# EAGLE design Motor CC (EAGLE 6.4)
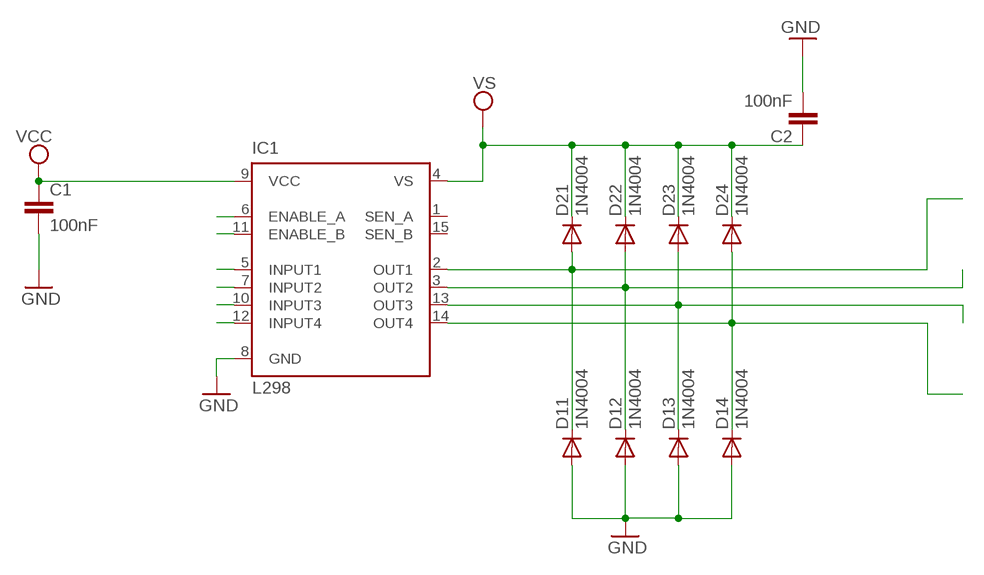
[diagram p0: schematic, sheet 1]

## Parts
C1  100nF  C-EU025-030X050  [C025-030X050]
C2  100nF  C-EU025-030X050  [C025-030X050]
D11  1N4004  [DO41-10]
D12  1N4004  [DO41-10]
D13  1N4004  [DO41-10]
D14  1N4004  [DO41-10]
D21  1N4004  [DO41-10]
D22  1N4004  [DO41-10]
D23  1N4004  [DO41-10]
D24  1N4004  [DO41-10]
IC1  L298  [MULTIWATT-15]

## Nets
GND: C1.2 C2.2 D11.A D12.A D13.A D14.A IC1.8(GND)
N$1: D14.C D24.A IC1.14(OUT4)
N$2: D11.C D21.A IC1.2(OUT1)
N$3: D12.C D22.A IC1.3(OUT2)
N$4: D13.C D23.A IC1.13(OUT3)
N$5: IC1.6(ENABLE_A)
N$6: IC1.11(ENABLE_B)
N$7: IC1.5(INPUT1)
N$8: IC1.7(INPUT2)
N$9: IC1.10(INPUT3)
N$10: IC1.12(INPUT4)
VSS: C1.1 C2.1 D21.C D22.C D23.C D24.C IC1.4(VS) IC1.9(VCC) ; supply symbol labelled VS, VCC
Unconnected: IC1.1(SEN_A) IC1.15(SEN_B)

## Library data of the parts
C1 C2 = resistor:C-EU: CAPACITOR, European symbol
D11-D14 D21-D24 = diode:1N4004: DIODE general purpose rectifier, 1 A
IC1 = st-microelectronics:L298: DUAL FULL-BRIDGE DRIVER; MPN: L298N; OC_FARNELL: 1589425; OC_NEWARK: 32M1527

## Board
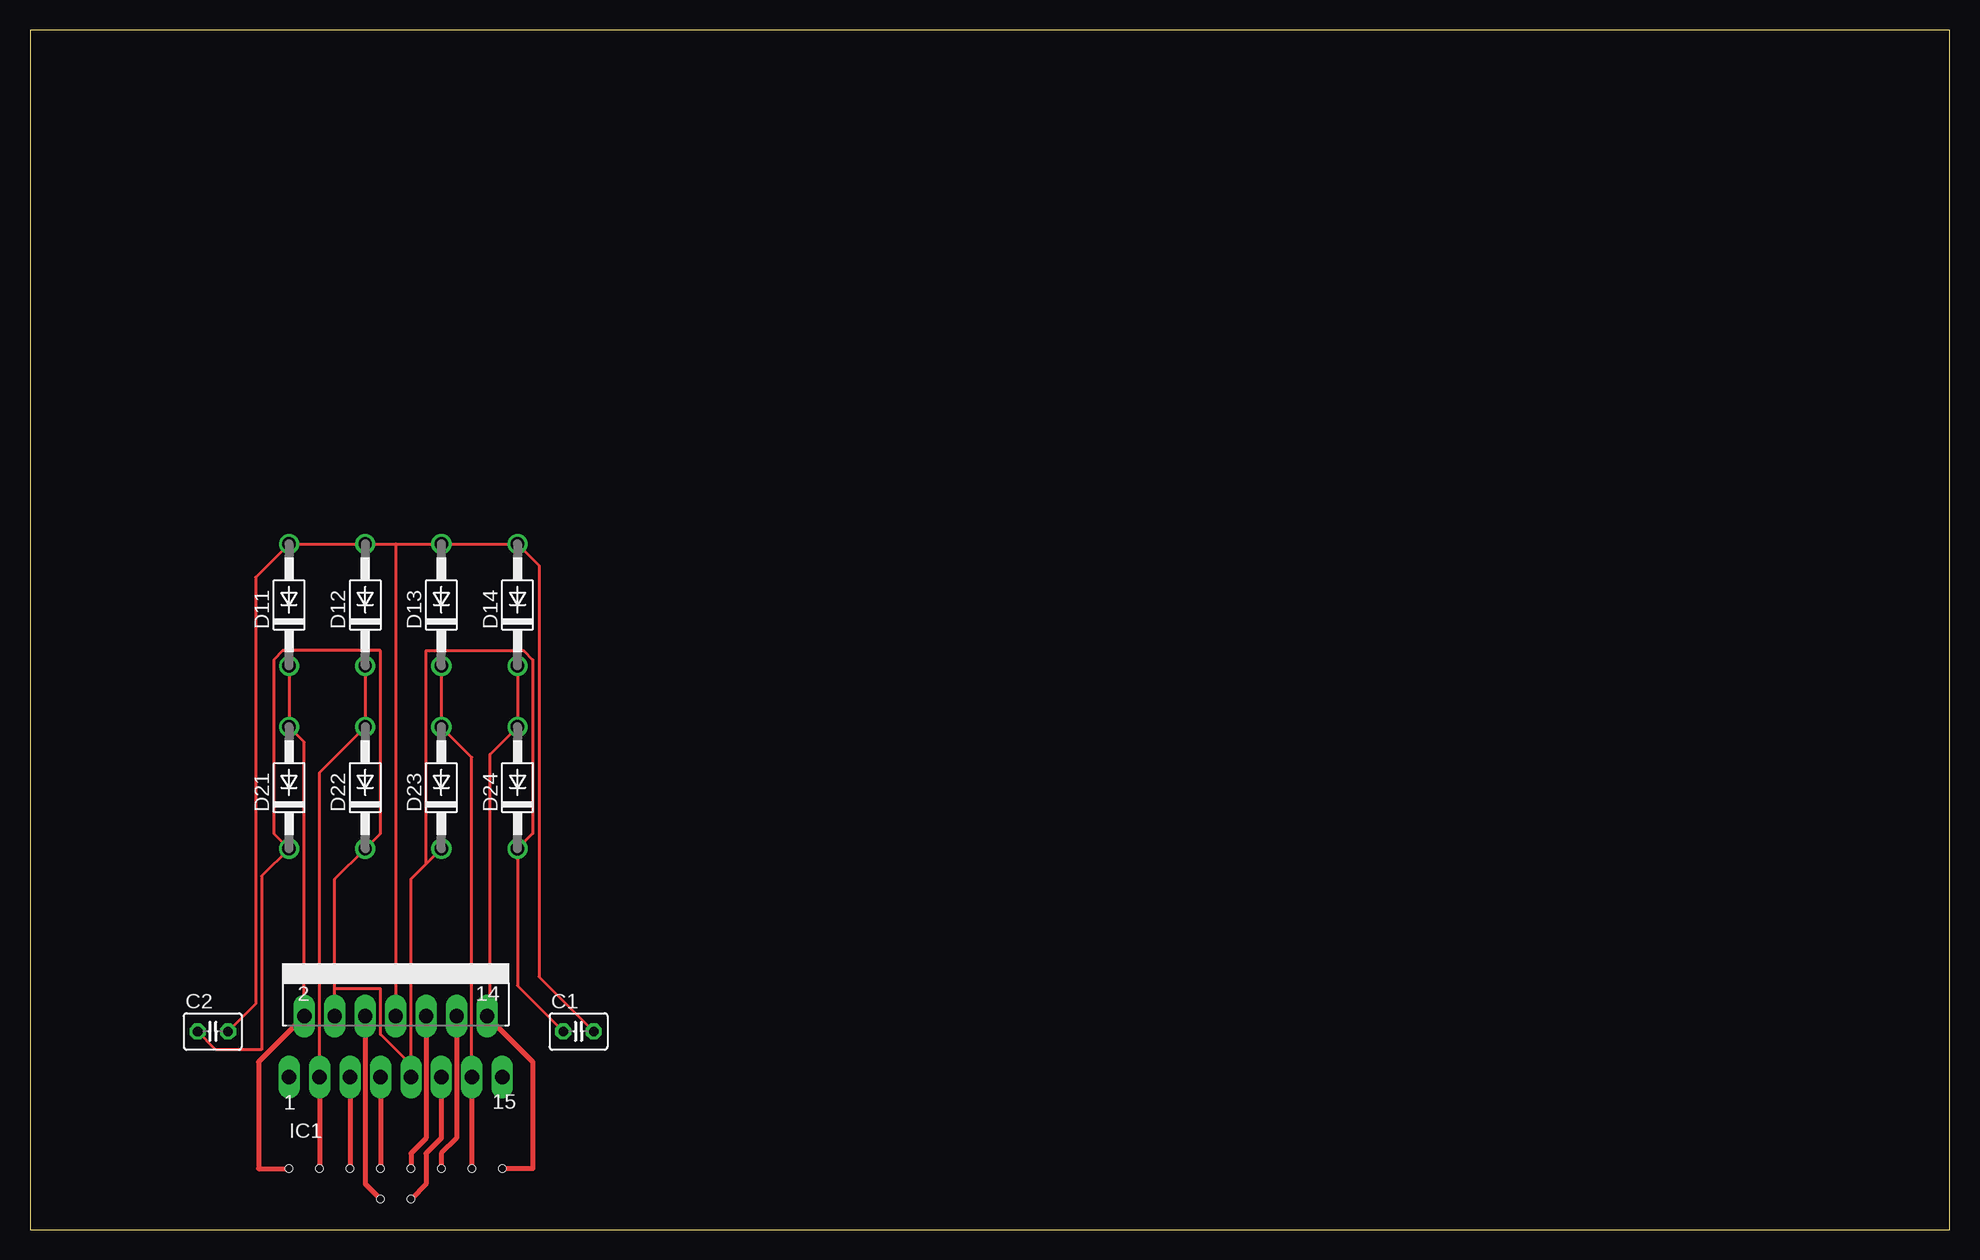
[diagram p1: board, top side]

Size 160 x 100 mm. Coordinates in mm from the lower left corner, seen from the top.
Outline: 0,0 160,0 160,100 0,100 0,0
Copper layers (1*16): Top 0.035mm / dielectric 1.5mm / Bottom 0.035mm
Design rules "default": minimum track width 10mil, minimum drill 24mil, track to track 8mil, track to pad 8mil, pad to pad 8mil, via to via 8mil, smd to smd 8mil, copper to edge 40mil, drill to drill 8mil, minimum pad ring 10mil, minimum via ring 8mil, stop-mask expansion 4mil, vias tented up to drill 0mil, thermal gap 10mil
Holes 0.6 mm at 21.59,5.08 24.13,5.08 26.67,5.08 29.21,2.54 29.21,5.08 31.75,5.08 31.75,2.54 34.29,5.08 36.83,5.08 39.37,5.08

### Footprints (pad centres in the part's own frame; a part is rotated, then mirrored left to right if it is on the bottom)
C025-030X050 = drill 0.813 octagon: 1 -1.27,0; 2 1.27,0
DO41-10 = drill 1.118: A 5.08,0; C -5.08,0
MULTIWATT-15 = drill 1.2 long: 1 -8.89,-7.62; 2 -7.62,-2.54; 3 -6.35,-7.62; 4 -5.08,-2.54; 5 -3.81,-7.62; 6 -2.54,-2.54; 7 -1.27,-7.62; 8 0,-2.54; 9 1.27,-7.62; 10 2.54,-2.54; 11 3.81,-7.62; 12 5.08,-2.54; 13 6.35,-7.62; 14 7.62,-2.54; 15 8.89,-7.62

### Placement (x,y rotation side)
C1  45.72,16.51 0 top
C2  15.24,16.51 0 top
D11  21.59,52.07 90 top
D12  27.94,52.07 90 top
D13  34.29,52.07 90 top
D14  40.64,52.07 90 top
D21  21.59,36.83 90 top
D22  27.94,36.83 90 top
D23  34.29,36.83 90 top
D24  40.64,36.83 90 top
IC1  30.48,20.32 0 top

### Tracks (layer width: path | path; a pad name or v marks a point on that pad's centre or on a via)
GND
  Top 0.254: C1.2 42.42,21.08 42.42,55.37 D14.A D13.A 30.48,57.15 | C2.2 18.8,18.8 18.8,54.36 D11.A D12.A 30.48,57.15 | 30.48,57.15 IC1.8
N$1
  Top 0.254: D14.C D24.A 38.35,39.62 38.35,17.78 IC1.14
  Top 0.406: IC1.14 41.91,13.97 41.91,5.08 39.37,5.08
N$2
  Top 0.254: D11.C D21.A 22.86,40.64 IC1.2
  Top 0.406: IC1.2 19.05,13.97 19.05,5.08 21.59,5.08
N$3
  Top 0.254: D12.C D22.A 24.13,38.1 IC1.3
  Top 0.406: IC1.3 24.13,5.08
N$4
  Top 0.254: D13.C D23.A 36.83,39.37 IC1.13
  Top 0.406: IC1.13 36.83,5.08
N$5
  Top 0.406: IC1.6 27.94,3.81 29.21,2.54
N$6
  Top 0.406: IC1.11 34.29,7.62 33.02,6.35 33.02,3.81 31.75,2.54
N$7
  Top 0.406: IC1.5 26.67,5.08
N$8
  Top 0.406: IC1.7 29.21,5.08
N$9
  Top 0.406: IC1.10 33.02,7.62 31.75,6.35 31.75,5.08
N$10
  Top 0.406: IC1.12 35.56,7.62 34.29,6.35 34.29,5.08
VSS
  Top 0.254: C2.1 15.49,14.99 19.3,14.99 19.3,29.46 D21.C 20.32,33.02 20.32,47.5 21.08,48.26 29.21,48.26 29.21,33.02 D22.C 25.4,29.21 25.4,20.07 | C1.1 40.64,20.32 D24.C 41.91,33.02 41.91,47.5 41.15,48.26 33.02,48.26 33.02,30.48 | IC1.4 25.4,20.07 | 33.02,30.48 31.75,29.21 31.75,13.72 | 33.02,30.48 D23.C | 25.4,20.07 29.21,20.07 29.21,16.26 31.75,13.72 | 31.75,13.72 IC1.9